# EAGLE schematic nixie_schema (EAGLE 8.2.0)

## Sheet 1 of 5: High Voltage tube driver logic
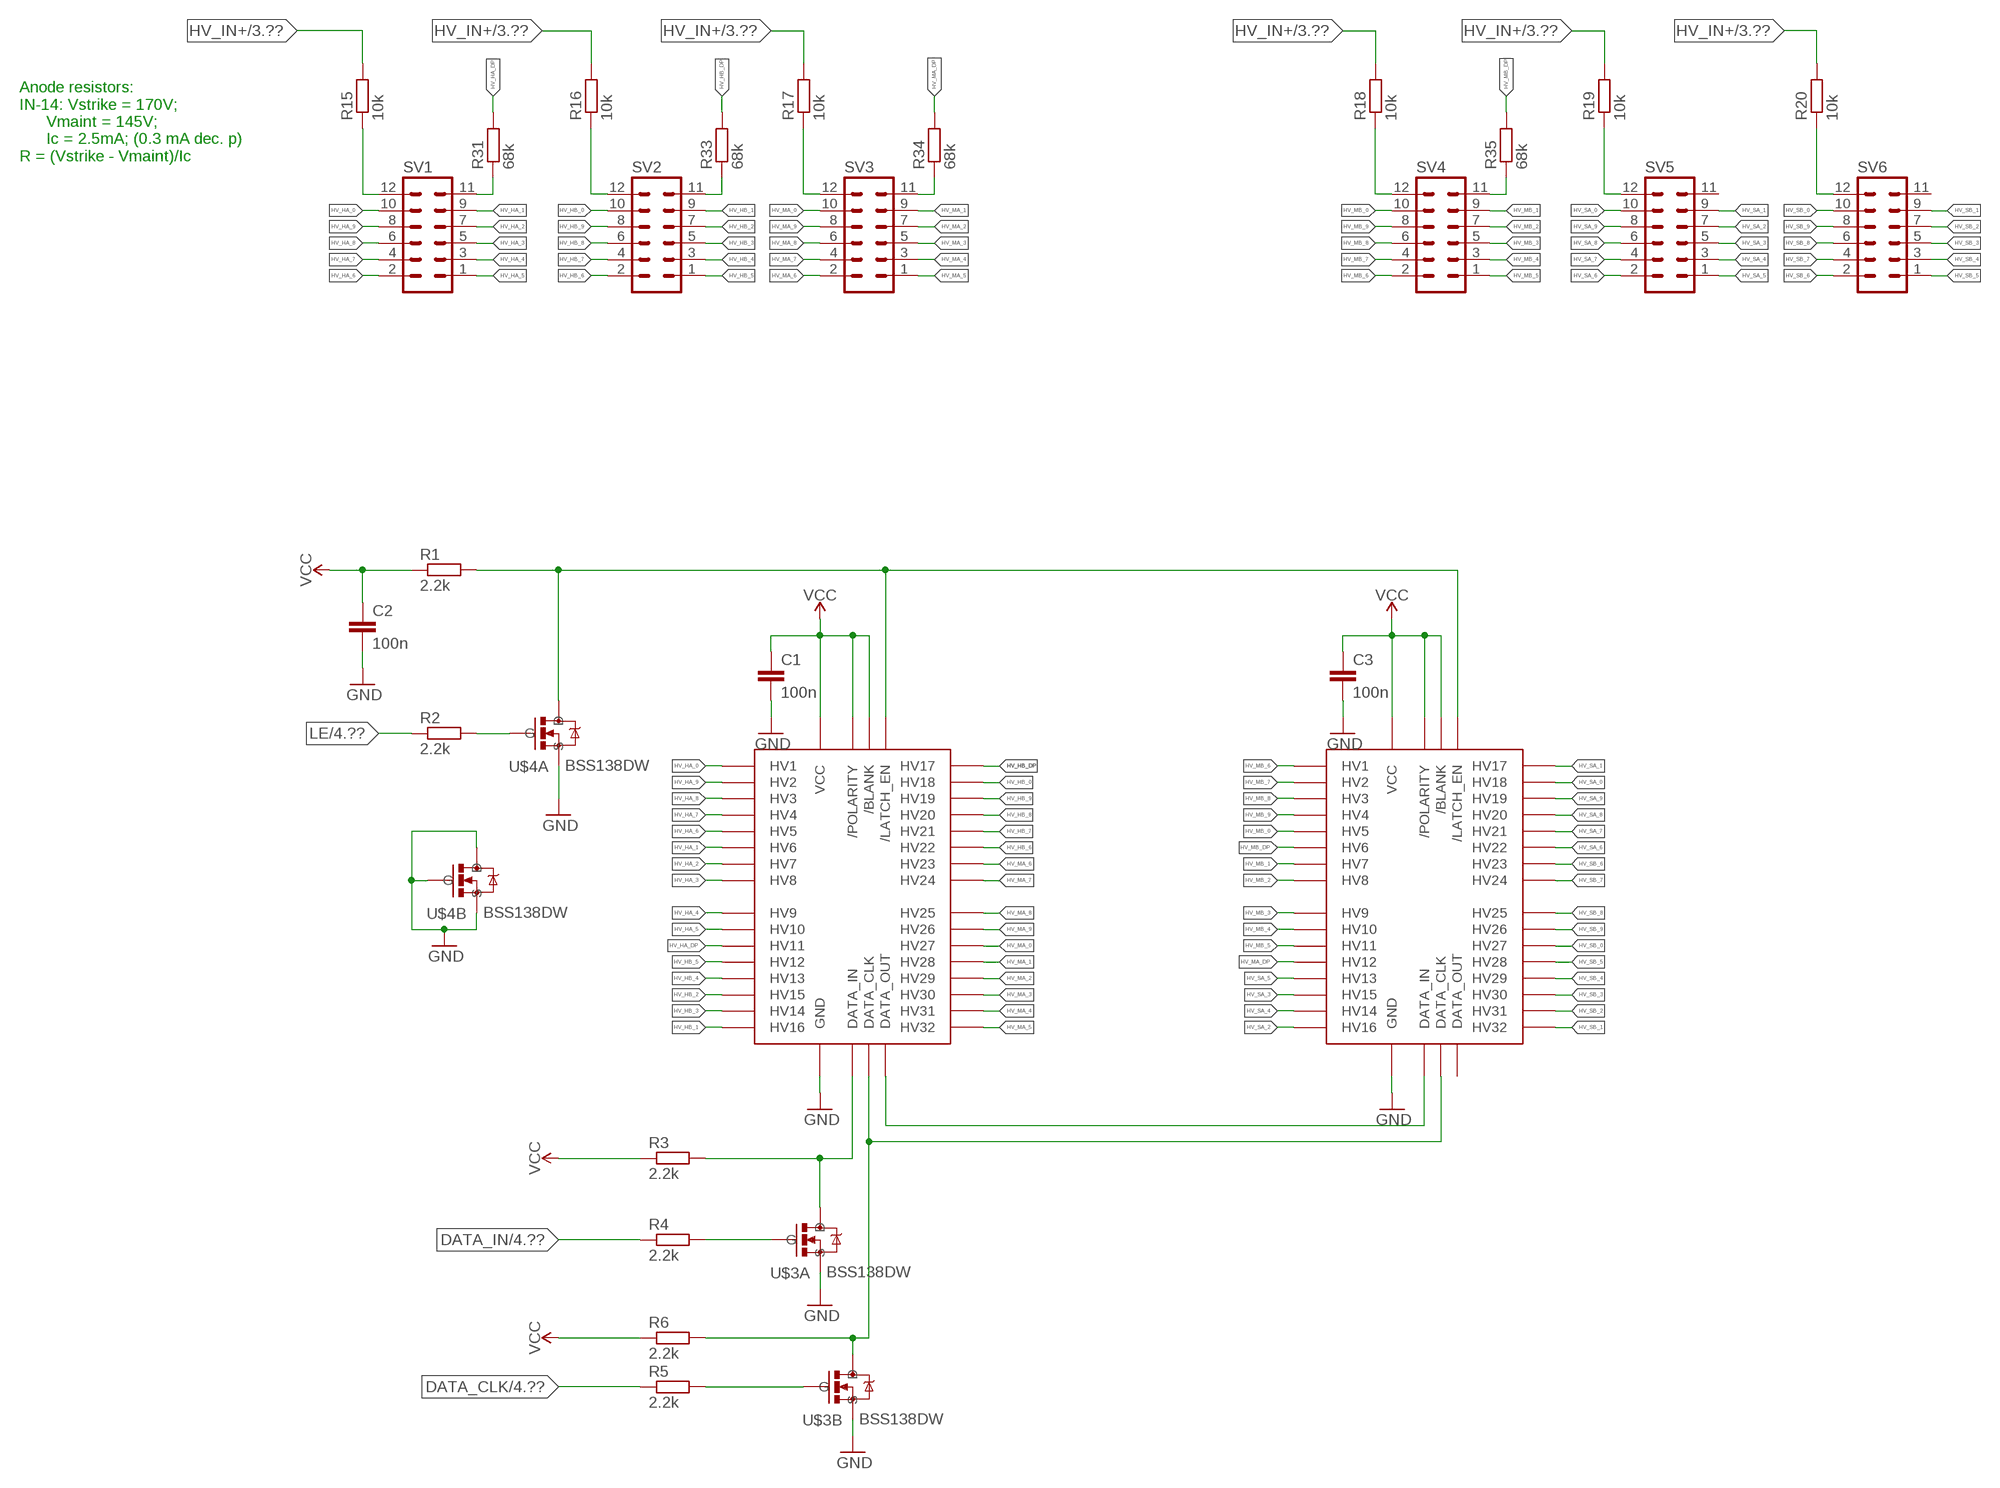
[diagram p0: schematic, sheet 1]

### Parts
C1  100n  C-EUC0805  [C0805]
C2  100n  C-EUC0805  [C0805]
C3  100n  C-EUC0805  [C0805]
R1  2.2k  R-EU_R0603  [R0603]
R2  2.2k  R-EU_R0603  [R0603]
R3  2.2k  R-EU_R0603  [R0603]
R4  2.2k  R-EU_R0603  [R0603]
R5  2.2k  R-EU_R0603  [R0603]
R6  2.2k  R-EU_R0603  [R0603]
R15  10k  R-EU_R0603  [R0603]
R16  10k  R-EU_R0603  [R0603]
R17  10k  R-EU_R0603  [R0603]
R18  10k  R-EU_R0603  [R0603]
R19  10k  R-EU_R0603  [R0603]
R20  10k  R-EU_R0603  [R0603]
R31  68k  R-EU_R0603  [R0603]
R33  68k  R-EU_R0603  [R0603]
R34  68k  R-EU_R0603  [R0603]
R35  68k  R-EU_R0603  [R0603]
SV1  MA06-2  [MA06-2]
SV2  MA06-2  [MA06-2]
SV3  MA06-2  [MA06-2]
SV4  MA06-2  [MA06-2]
SV5  MA06-2  [MA06-2]
SV6  MA06-2  [MA06-2]
U$1  HV5522  [CQFP-44]
U$2  HV5522  [CQFP-44]
U$3  BSS138DW  [SOT-363]
U$4  BSS138DW  [SOT-363]

### Nets
DATA_CLK: R5.1 ; also sheet 4
DATA_IN: R4.1 ; also sheet 4
GND: C1.2 C2.2 C3.2 U$1.24(GND) U$1.25(GND) U$1.26(GND) U$1.29(GND) U$1.34(GND) U$2.24(GND) U$2.25(GND) U$2.26(GND) U$2.29(GND) U$2.34(GND) U$3.1(A:S) U$3.4(B:S) U$4.1(A:S) U$4.3(B:D) U$4.4(B:S) U$4.5(B:G) ; also sheet 2,3,4
HV_DATA_CLK: R6.2 U$1.28(DATA_CLK) U$2.28(DATA_CLK) U$3.3(B:D)
HV_DATA_IN: R3.2 U$1.32(DATA_IN) U$3.6(A:D)
HV_DATA_OUT: U$1.23(DATA_OUT) U$2.32(DATA_IN)
HV_HA_0: SV1.10 U$1.35(HV1)
HV_HA_1: SV1.9 U$1.40(HV6)
HV_HA_2: SV1.7 U$1.41(HV7)
HV_HA_3: SV1.5 U$1.42(HV8)
HV_HA_4: SV1.3 U$1.43(HV9)
HV_HA_5: SV1.1 U$1.44(HV10)
HV_HA_6: SV1.2 U$1.39(HV5)
HV_HA_7: SV1.4 U$1.38(HV4)
HV_HA_8: SV1.6 U$1.37(HV3)
HV_HA_9: SV1.8 U$1.36(HV2)
HV_HA_DP: R31.2 U$1.1(HV11)
HV_HB_0: SV2.10 U$1.8(HV18)
HV_HB_1: SV2.9 U$1.6(HV16)
HV_HB_2: SV2.7 U$1.5(HV15)
HV_HB_3: SV2.5 U$1.4(HV14)
HV_HB_4: SV2.3 U$1.3(HV13)
HV_HB_5: SV2.1 U$1.2(HV12)
HV_HB_6: SV2.2 U$1.12(HV22)
HV_HB_7: SV2.4 U$1.11(HV21)
HV_HB_8: SV2.6 U$1.10(HV20)
HV_HB_9: SV2.8 U$1.9(HV19)
HV_HB_DP: R33.2 U$1.7(HV17)
HV_IN+ [HV]: R15.2 R16.2 R17.2 R18.2 R19.2 R20.2 ; also sheet 3
HV_LE: R1.2 U$1.31(/LATCH_EN) U$2.31(/LATCH_EN) U$4.6(A:D)
HV_MA_0: SV3.10 U$1.17(HV27)
HV_MA_1: SV3.9 U$1.18(HV28)
HV_MA_2: SV3.7 U$1.19(HV29)
HV_MA_3: SV3.5 U$1.20(HV30)
HV_MA_4: SV3.3 U$1.21(HV31)
HV_MA_5: SV3.1 U$1.22(HV32)
HV_MA_6: SV3.2 U$1.13(HV23)
HV_MA_7: SV3.4 U$1.14(HV24)
HV_MA_8: SV3.6 U$1.15(HV25)
HV_MA_9: SV3.8 U$1.16(HV26)
HV_MA_DP: R34.2 U$2.2(HV12)
HV_MB_0: SV4.10 U$2.39(HV5)
HV_MB_1: SV4.9 U$2.41(HV7)
HV_MB_2: SV4.7 U$2.42(HV8)
HV_MB_3: SV4.5 U$2.43(HV9)
HV_MB_4: SV4.3 U$2.44(HV10)
HV_MB_5: SV4.1 U$2.1(HV11)
HV_MB_6: SV4.2 U$2.35(HV1)
HV_MB_7: SV4.4 U$2.36(HV2)
HV_MB_8: SV4.6 U$2.37(HV3)
HV_MB_9: SV4.8 U$2.38(HV4)
HV_MB_DP: R35.2 U$2.40(HV6)
HV_SA_0: SV5.10 U$2.8(HV18)
HV_SA_1: SV5.9 U$2.7(HV17)
HV_SA_2: SV5.7 U$2.6(HV16)
HV_SA_3: SV5.5 U$2.5(HV15)
HV_SA_4: SV5.3 U$2.4(HV14)
HV_SA_5: SV5.1 U$2.3(HV13)
HV_SA_6: SV5.2 U$2.12(HV22)
HV_SA_7: SV5.4 U$2.11(HV21)
HV_SA_8: SV5.6 U$2.10(HV20)
HV_SA_9: SV5.8 U$2.9(HV19)
HV_SB_0: SV6.10 U$2.17(HV27)
HV_SB_1: SV6.9 U$2.22(HV32)
HV_SB_2: SV6.7 U$2.21(HV31)
HV_SB_3: SV6.5 U$2.20(HV30)
HV_SB_4: SV6.3 U$2.19(HV29)
HV_SB_5: SV6.1 U$2.18(HV28)
HV_SB_6: SV6.2 U$2.13(HV23)
HV_SB_7: SV6.4 U$2.14(HV24)
HV_SB_8: SV6.6 U$2.15(HV25)
HV_SB_9: SV6.8 U$2.16(HV26)
LE: R2.1 ; also sheet 4
N$3: R2.2 U$4.2(A:G)
N$4: R4.2 U$3.2(A:G)
N$8 [HV]: R18.1 SV4.12
N$9: R5.2 U$3.5(B:G)
N$11 [HV]: R17.1 SV3.12
N$89 [HV]: R15.1 SV1.12
N$90 [HV]: R16.1 SV2.12
N$91 [HV]: R20.1 SV6.12
N$92 [HV]: R19.1 SV5.12
N$106: R31.1 SV1.11
N$108: R33.1 SV2.11
N$110: R34.1 SV3.11
N$112: R35.1 SV4.11
VCC [Power]: C1.1 C2.1 C3.1 R1.1 R3.1 R6.1 U$1.27(/POLARITY) U$1.30(VCC) U$1.33(/BLANK) U$2.27(/POLARITY) U$2.30(VCC) U$2.33(/BLANK) ; also sheet 2,3
Unconnected: SV5.11 SV6.11 U$2.23(DATA_OUT)

### Notes on the sheet
- Anode resistors:
  IN-14: Vstrike = 170V;
        Vmaint = 145V;
        Ic = 2.5mA; (0.3 mA dec. p)
  R = (Vstrike - Vmaint)/Ic

## Sheet 2 of 5: Power Supplies Low voltage
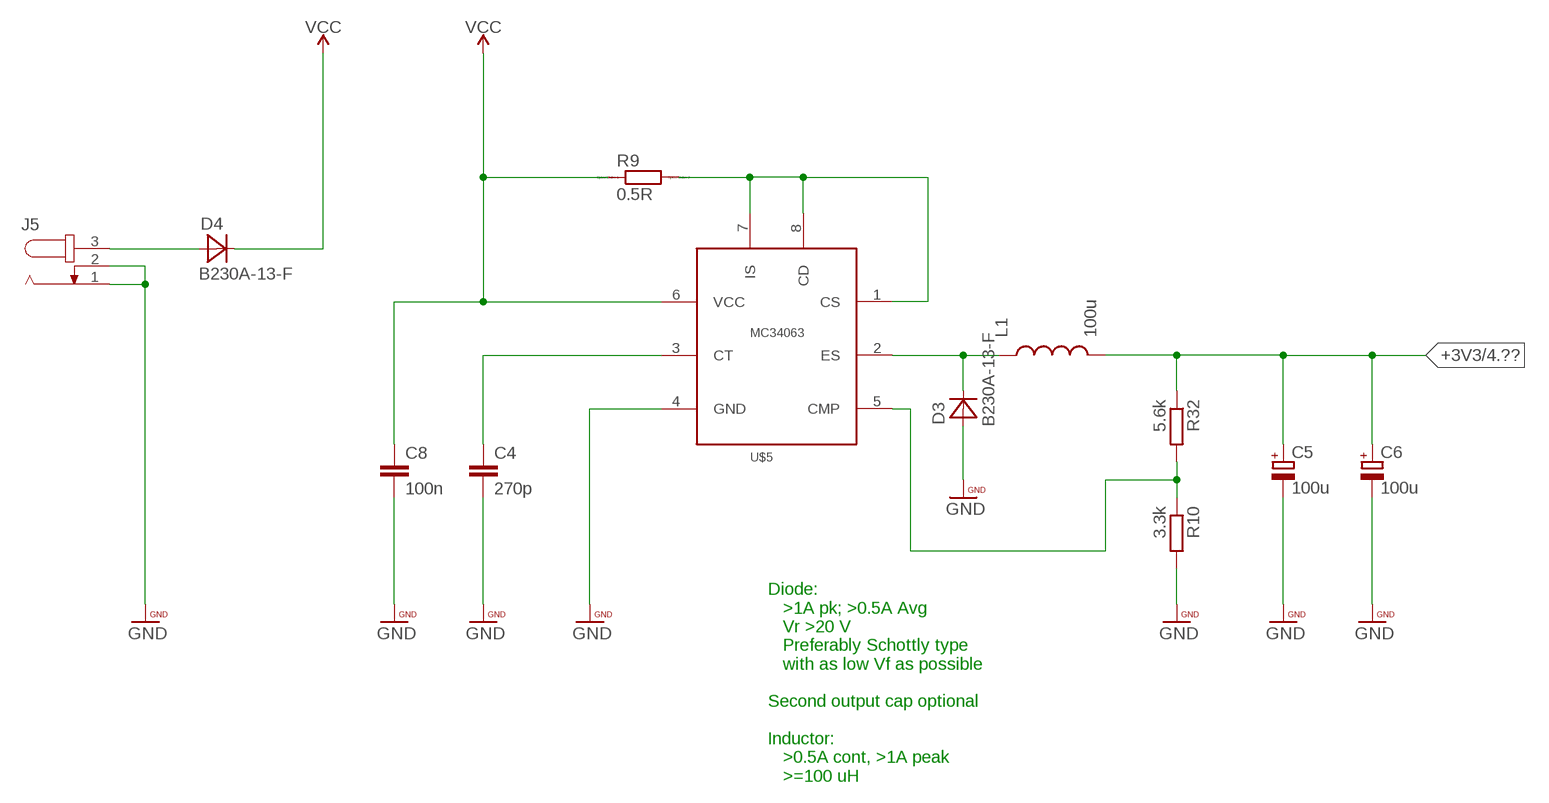
[diagram p1: schematic, sheet 2]

### Parts
C4  270p  C-EUC0805  [C0805]
C5  100u  CPOL-EU153CLV-1014  [153CLV-1014]
C6  100u  CPOL-EU153CLV-1014  [153CLV-1014]
C8  100n  C-EUC0805  [C0805]
D3  B230A-13-F  [SMA/SMB]
D4  B230A-13-F  [SMA/SMB]
J5  JACK-PLUG0  [SPC4077]
L1  100u  HM78D-128151KLFTR  [INDUCTOR_PACKAGE]
R9  0.5R  RR1210  [R1210]
R10  3.3k  R-EU_R0603  [R0603]
R32  5.6k  R-EU_R0603  [R0603]
U$5  MC34063  [SOIC08]

### Nets
+3V3 [medium power]: C5.+ C6.+ L1.P$2 R32.1 ; also sheet 4
GND: C4.2 C5.- C6.- C8.2 D3.A J5.1 J5.2 R10.2 U$5.4(GND) ; also sheet 1,3,4
N$5 [medium power]: R9.2 U$5.1(CS) U$5.7(IS) U$5.8(CD)
N$12: C4.1 U$5.3(CT)
N$13 [medium power]: D3.C L1.P$1 U$5.2(ES)
N$93 [Power]: D4.A J5.3
N$103: R10.1 R32.2 U$5.5(CMP)
VCC [Power]: C8.1 D4.C R9.1 U$5.6(VCC) ; also sheet 1,3

### Notes on the sheet
- Diode:
     >1A pk; >0.5A Avg
     Vr >20 V
     Preferably Schottly type
     with as low Vf as possible
  
  Second output cap optional
  
  Inductor:
     >0.5A cont, >1A peak
     >=100 uH

## Sheet 3 of 5: Power supply High Voltage
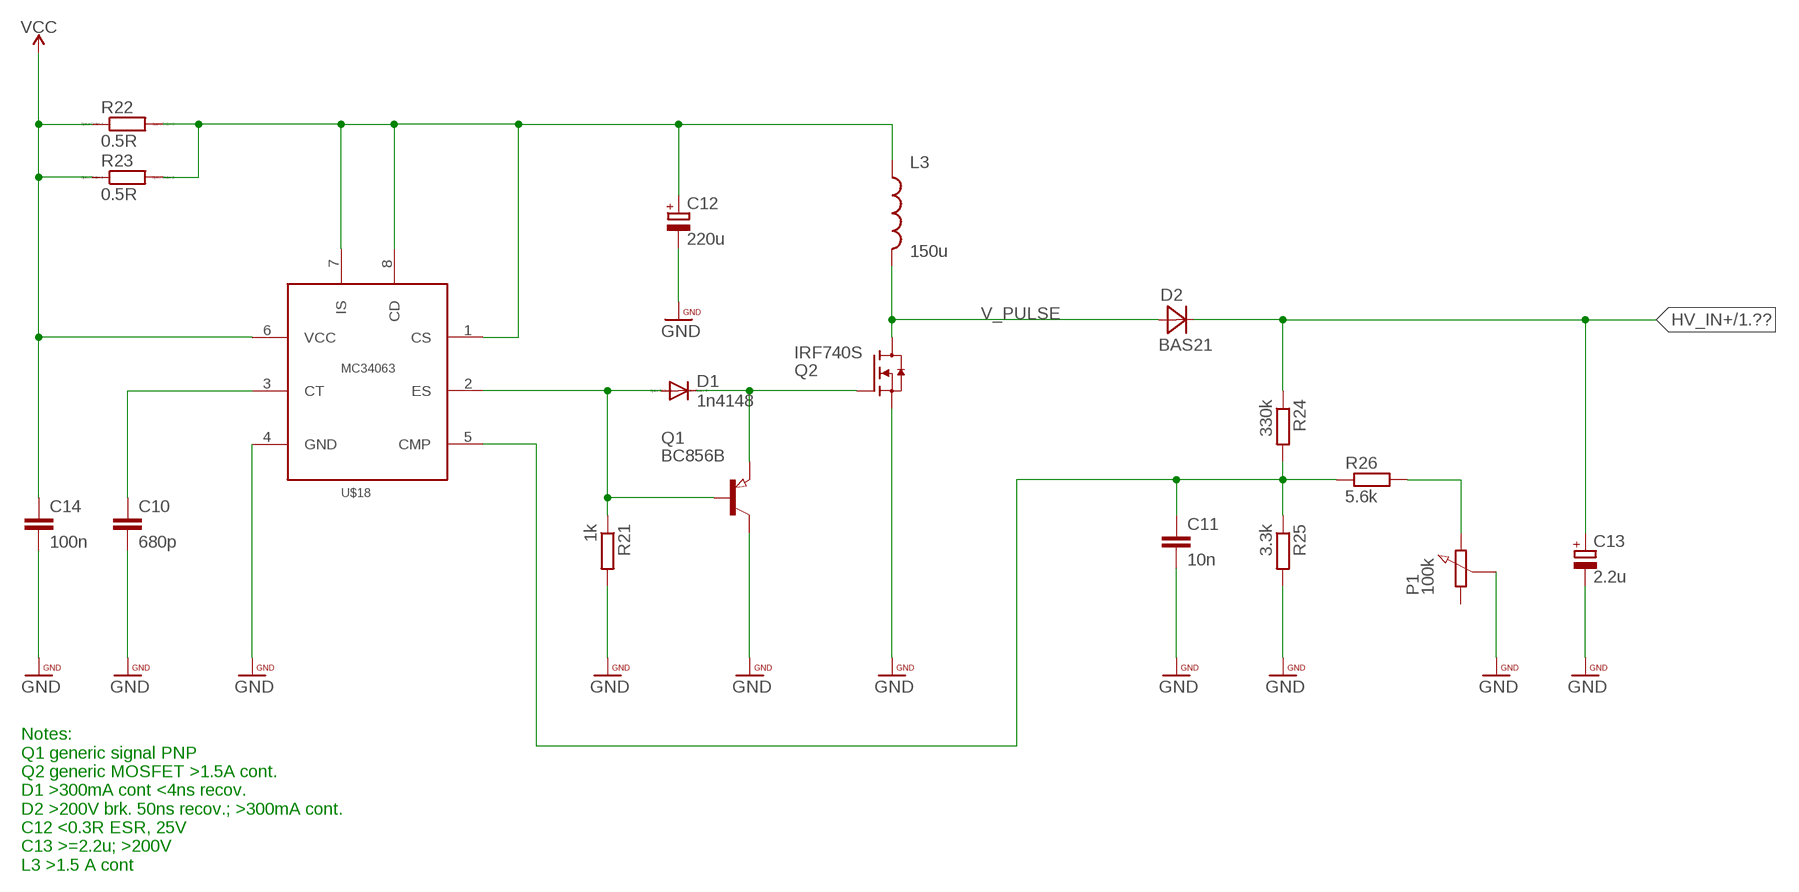
[diagram p2: schematic, sheet 3]

### Parts
C10  680p  C-EUC0805  [C0805]
C11  10n  C-EUC0805  [C0805]
C12  220u  CPOL-EU153CLV-1014  [153CLV-1014]
C13  2.2u  CPOL-EU153CLV-1014  [153CLV-1014]
C14  100n  C-EUC0805  [C0805]
D1  1n4148  DIODE-SOD123  [SOD123]
D2  BAS21  [SOT23]
L3  150u  HM78D-128151KLFTR  [INDUCTOR_PACKAGE]
P1  100k  UNIVERSAL-POTENTIOMETER_SMD  [UNI_POT_SMD]
Q1  BC856B  [SOT23]
Q2  IRF740S  [D2PACK]
R21  1k  R-EU_R0603  [R0603]
R22  0.5R  RR1210  [R1210]
R23  0.5R  RR1210  [R1210]
R24  330k  R-EU_R0603  [R0603]
R25  3.3k  R-EU_R0603  [R0603]
R26  5.6k  R-EU_R0603  [R0603]
U$18  MC34063  [SOIC08]

### Nets
GND: C10.2 C11.2 C12.- C13.- C14.2 P1.P$2(WIPER) Q1.3(C) Q2.3(S) R21.2 R25.2 U$18.4(GND) ; also sheet 1,2,4
HV_IN+ [HV]: C13.+ D2.3(C) R24.1 ; also sheet 1
N$74: C10.1 U$18.3(CT)
N$85: D1.A Q1.1(B) R21.1 U$18.2(ES)
N$87 [Power]: C12.+ L3.P$1 R22.2 R23.2 U$18.1(CS) U$18.7(IS) U$18.8(CD)
N$95: D1.C Q1.2(E) Q2.1(G)
N$96: C11.1 R24.2 R25.1 R26.1 U$18.5(CMP)
N$97: P1.P$3(E) R26.2
V_PULSE [HV]: D2.1(A) L3.P$2 Q2.2(D)
VCC [Power]: C14.1 R22.1 R23.1 U$18.6(VCC) ; also sheet 1,2
Unconnected: P1.P$1(A)

### Notes on the sheet
- Notes:
  Q1 generic signal PNP
  Q2 generic MOSFET >1.5A cont.
  D1 >300mA cont <4ns recov.
  D2 >200V brk. 50ns recov.; >300mA cont.
  C12 <0.3R ESR, 25V
  C13 >=2.2u; >200V
  L3 >1.5 A cont

## Sheet 4 of 5: ESP8266 Controller
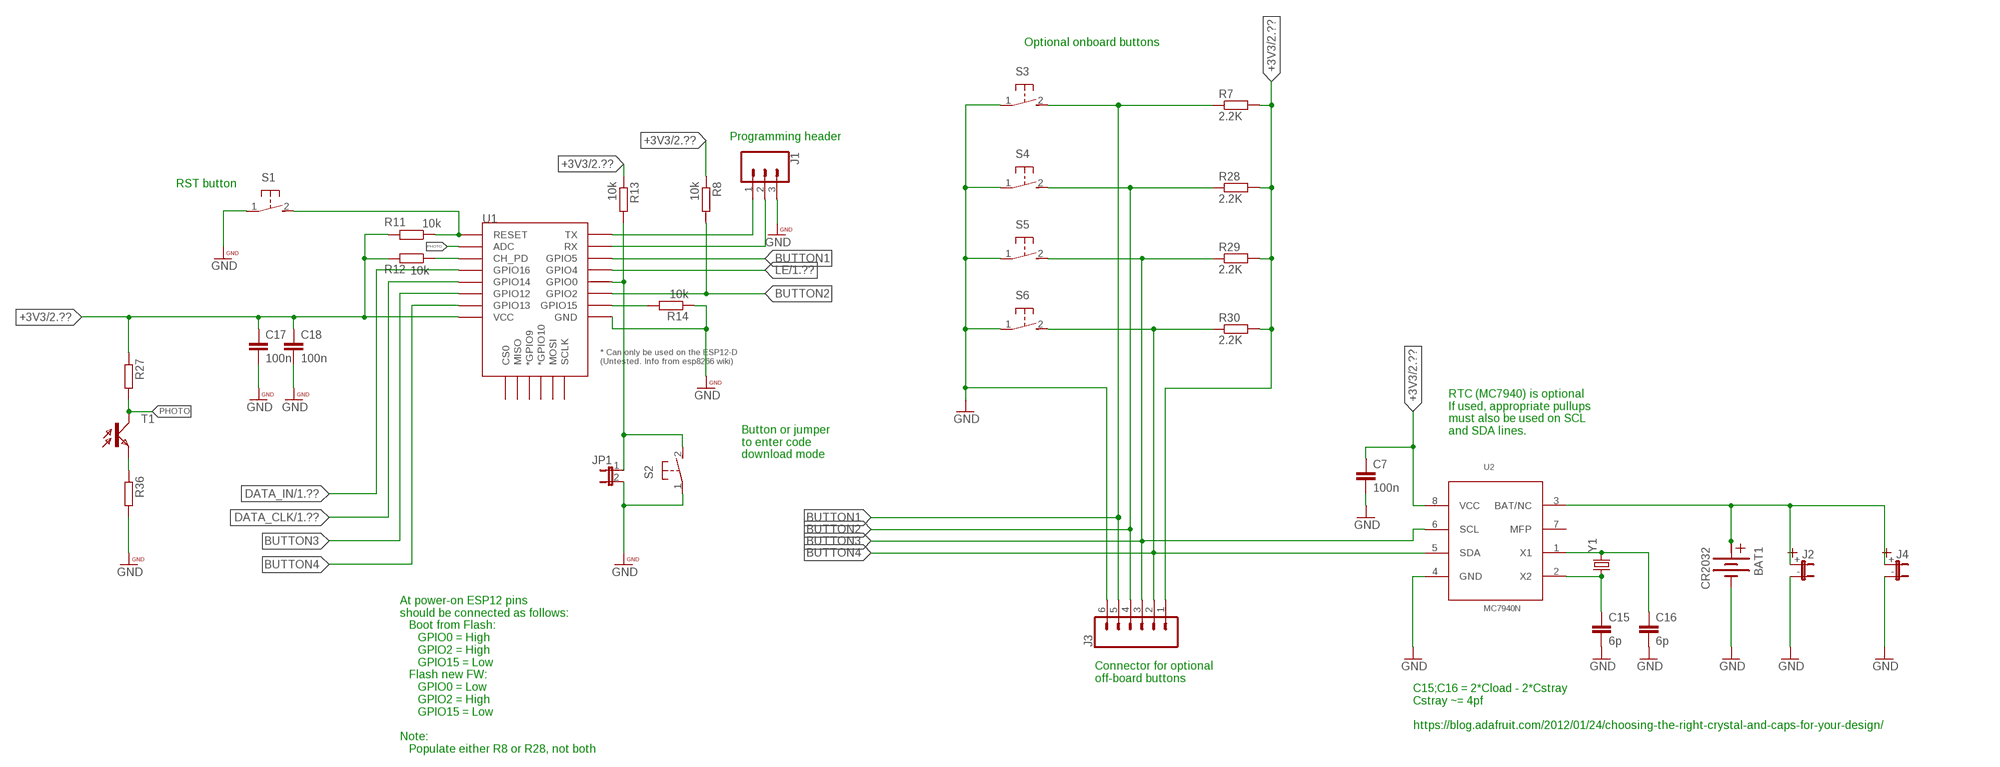
[diagram p3: schematic, sheet 4]

### Parts
BAT1  CR2032  [CR2032]
C7  100n  C-EUC0805  [C0805]
C15  6p  C-EUC0805  [C0805]
C16  6p  C-EUC0805  [C0805]
C17  100n  C-EUC0805  [C0805]
C18  100n  C-EUC0805  [C0805]
J1  CONN_03  [1X03]
J2  RTC_CONSMD  [PICOBLADE_SMD_2]
J3  CONN_06NO_SILK_FEMALE_PTH  [1X06_NO_SILK]
J4  RTC_CONTHT  [PICOBLADE_THT_2]
JP1  JUMPER2  [JUMPER2]
R7  2.2K  R-EU_R0603  [R0603]
R8  10k  R-EU_R0603  [R0603]
R11  10k  R-EU_R0603  [R0603]
R12  10k  R-EU_R0603  [R0603]
R13  10k  R-EU_R0603  [R0603]
R14  10k  R-EU_R0603  [R0603]
R27  R-EU_R0603  [R0603]
R28  2.2K  R-EU_R0603  [R0603]
R29  2.2K  R-EU_R0603  [R0603]
R30  2.2K  R-EU_R0603  [R0603]
R36  R-EU_R0603  [R0603]
S1  31-XX  [B3F-31XX]
S2  31-XX  [B3F-31XX]
S3  31-XX  [B3F-31XX]
S4  31-XX  [B3F-31XX]
S5  31-XX  [B3F-31XX]
S6  31-XX  [B3F-31XX]
T1  PHOTO_TRANS  [C0805K]
U1  ESP12ESMD  [ESP12E-SMD]
U2  MC7940N  [SOIC8-N_MC]
Y1  ECS-.327-7-34B  [CRYSTAL_PACK]

### Nets
+3V3 [medium power]: C7.1 C17.1 C18.1 J3.1 R7.2 R8.1 R11.2 R12.2 R13.1 R27.1 R28.2 R29.2 R30.2 U1.VCC U2.8(VCC) ; also sheet 2
BUTTON1: J3.5 R7.1 S3.2(S) U1.GPIO5
BUTTON2: J3.4 R8.2 R28.1 S4.2(S) U1.GPIO2
BUTTON3: J3.3 R29.1 S5.2(S) U1.GPIO12 U2.6(SCL)
BUTTON4: J3.2 R30.1 S6.2(S) U1.GPIO13 U2.5(SDA)
DATA_CLK: U1.GPIO14 ; also sheet 1
DATA_IN: U1.GPIO16 ; also sheet 1
GND: BAT1.- C7.2 C15.2 C16.2 C17.2 C18.2 J1.3 J2.- J3.6 J4.- JP1.2 R14.1 R36.2 S1.1(P) S2.1(P) S3.1(P) S4.1(P) S5.1(P) S6.1(P) U1.GND U2.4(GND) ; also sheet 1,2,3
LE: U1.GPIO4 ; also sheet 1
N$14: R11.1 S1.2(S) U1.RESET
N$15: JP1.1 R13.2 S2.2(S) U1.GPIO0
N$16: R12.1 U1.CH_PD
N$17: J1.1 U1.TXD0(TX)
N$18: J1.2 U1.RXD0(RX)
N$20: R14.2 U1.GPIO15
N$22 [medium power]: BAT1.+_1(+) J2.+ J4.+ U2.3(BAT/NC)
N$99: C16.1 U2.1(X1) Y1.P$2
N$100: C15.1 U2.2(X2) Y1.P$1
N$109: R36.1 T1.EMI(E)
PHOTO: R27.2 T1.COL(C) U1.ADC
Unconnected: U1.CS0 U1.GPIO9(*GPIO9) U1.GPIO10(*GPIO10) U1.MISO U1.MOSI U1.SCLK U2.7(MFP)

### Notes on the sheet
- Optional onboard buttons
- Programming header
- RST button
- RTC (MC7940) is optional
  If used, appropriate pullups
  must also be used on SCL
  and SDA lines.
- Button or jumper
  to enter code
  download mode
- Connector for optional
  off-board buttons
- C15;C16 = 2*Cload - 2*Cstray
  Cstray ~= 4pf
  
  https://blog.adafruit.com/2012/01/24/choosing-the-right-crystal-and-caps-for-your-design/
- At power-on ESP12 pins
  should be connected as follows:
     Boot from Flash:
        GPIO0 = High
        GPIO2 = High
        GPIO15 = Low
     Flash new FW:
        GPIO0 = Low
        GPIO2 = High
        GPIO15 = Low
  
  Note:
     Populate either R8 or R28, not both

## Sheet 5 of 5: Daugther board for Nixies
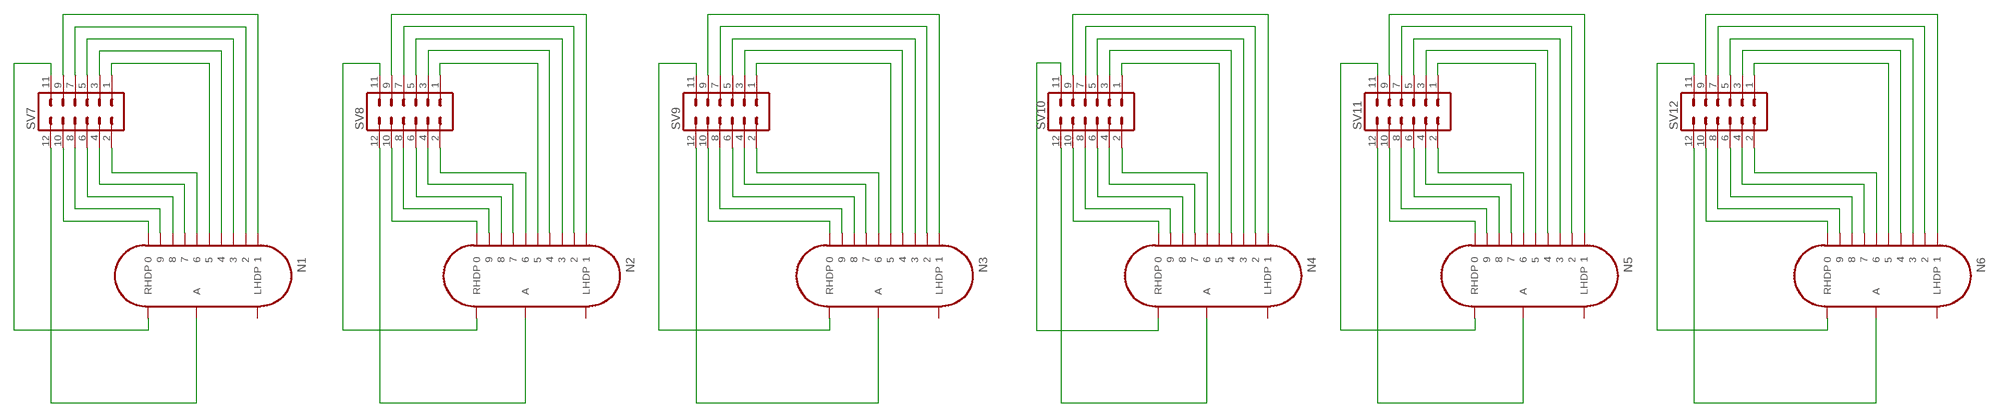
[diagram p4: schematic, sheet 5]

### Parts
N1  IN-14_FIXED  [IN-14]
N2  IN-14_FIXED  [IN-14]
N3  IN-14_FIXED  [IN-14]
N4  IN-14_FIXED  [IN-14]
N5  IN-14_FIXED  [IN-14]
N6  IN-14_FIXED  [IN-14]
SV7  MA06-2  [MA06-2]
SV8  MA06-2  [MA06-2]
SV9  MA06-2  [MA06-2]
SV10  MA06-2  [MA06-2]
SV11  MA06-2  [MA06-2]
SV12  MA06-2  [MA06-2]

### Nets
N$1: N2.RHDP SV8.11
N$2: N1.6 SV7.2
N$6: N1.7 SV7.4
N$7: N1.8 SV7.6
N$10 [HV]: N1.A SV7.12
N$19 [HV]: N2.A SV8.12
N$21 [HV]: N3.A SV9.12
N$23: N2.6 SV8.2
N$24: N1.9 SV7.8
N$25: N1.1 SV7.9
N$26: N1.2 SV7.7
N$27: N1.3 SV7.5
N$28: N1.4 SV7.3
N$29: N1.5 SV7.1
N$30: N1.RHDP SV7.11
N$31: N2.7 SV8.4
N$32: N2.8 SV8.6
N$33: N2.9 SV8.8
N$34: N2.0 SV8.10
N$35: N3.RHDP SV9.11
N$36: N3.6 SV9.2
N$37: N3.7 SV9.4
N$38: N2.5 SV8.1
N$39: N2.4 SV8.3
N$40: N2.3 SV8.5
N$41: N2.2 SV8.7
N$42: N2.1 SV8.9
N$43: N3.8 SV9.6
N$44: N3.9 SV9.8
N$45 [HV]: N6.A SV12.12
N$46: N3.0 SV9.10
N$47: N4.RHDP SV10.11
N$48: N4.6 SV10.2
N$49: N3.5 SV9.1
N$50: N3.4 SV9.3
N$51: N3.3 SV9.5
N$52: N3.2 SV9.7
N$53: N3.1 SV9.9
N$54: N4.7 SV10.4
N$55: N4.8 SV10.6
N$56: N4.9 SV10.8
N$57: N4.0 SV10.10
N$58: N5.RHDP SV11.11
N$59: N4.5 SV10.1
N$60: N4.4 SV10.3
N$61: N4.3 SV10.5
N$62: N4.2 SV10.7
N$63: N4.1 SV10.9
N$64: N5.6 SV11.2
N$65: N5.7 SV11.4
N$66: N5.8 SV11.6
N$67: N5.9 SV11.8
N$68: N5.0 SV11.10
N$69: N5.5 SV11.1
N$70: N5.4 SV11.3
N$71: N5.3 SV11.5
N$72: N5.2 SV11.7
N$73: N5.1 SV11.9
N$75: N6.RHDP SV12.11
N$76: N6.6 SV12.2
N$77: N6.7 SV12.4
N$78: N6.8 SV12.6
N$79: N6.9 SV12.8
N$80: N6.5 SV12.1
N$81: N6.4 SV12.3
N$82: N6.3 SV12.5
N$83: N6.2 SV12.7
N$84: N6.1 SV12.9
N$86: N6.0 SV12.10
N$88 [HV]: N4.A SV10.12
N$94: N1.0 SV7.10
N$98 [HV]: N5.A SV11.12
Unconnected: N1.LHDP N2.LHDP N3.LHDP N4.LHDP N5.LHDP N6.LHDP

## Power pins joined to a net without a drawn wire
+: BAT1.+_2(+)

## Library data of the parts
BAT1 = nixe_cmp:CR2032: CR2032 universal battery holder This footprint should fit many different CR2032 battery holders such as this <http://www.memoryprotectiondevices.com/datasheets/BK-912-G-TR-datasheet.pdf>, this <http://www.memoryprotectiondevices.com/datasheets/BC-2003-datasheet.pdf> or this <http://www.memoryprotectiondevices.com/datasheets/BK-913-datasheet.pdf> both SMT and THT style.
C1-C4 C7 C8 C10 C11 C14-C18 = rcl:C-EU: CAPACITOR, European symbol
C5 C6 C12 C13 = rcl:CPOL-EU: POLARIZED CAPACITOR, European symbol
D1 = diode:DIODE-: DIODE
D2 = nixe_cmp:BAS21: BAS21 200V diode General purpose 200V diode in SOT-23 package Datasheet: https://www.elfa.se/en/diode-sot-23-200-infineon-bas21/p/17030082
D3 D4 = nixe_cmp:B230A-13-F: Schottky Rectifier diode Datasheet <http://www.mouser.com/ds/2/115/ds13004-70120.pdf>; I_AVG: 2.0 A; I_FSM: 50 A; RMS_REV: 21 V; V_REV: 30 V
J1 = SparkFun-Connectors:CONN_03: Multi connection point. Often used as Generic Header-pin footprint for 0.1 inch spaced/style header connections On any of the 0.1 inch spaced packages, you can populate with these: Break Away Headers - Straight <https://www.sparkfun.com/products/116> (PRT-00116) Break Away Male Headers - Right Angle <https://www.sparkfun.com/products/553> (PRT-00553) Female Headers <https://www.sparkfun.com/products/115> (PRT-00115) Break Away Headers - Machine Pin <https://www.sparkfun.com/products/117> (PRT-00117) Break Away Female Headers - Swiss Machine Pin <https://www.sparkfun.com/products/743> (PRT-00743) Stackable Header - 3 Pin (Female, 0.1") <https://www.sparkfun.com/products/13875> (PRT-13875) For SCREWTERMINALS and SPRING TERMINALS visit here: Screw Terimnals on SparkFun.com <https://www.sparkfun.com/search/results?term=Screw+Terminals> (5mm/3.5mm/2.54mm spacing) This device is also useful as a general connection point to wire up your design to another part of your project. Our various solder wires solder well into these plated through hole pads. Hook-Up Wire - Assortment (Stranded, 22 AWG) <https://www.sparkfun.com/products/11375> (PRT-11375) Hook-Up Wire - Assortment (Solid Core, 22 AWG) <https://www.sparkfun.com/products/11367> (PRT-11367) View the entire wire category on our website here <https://www.sparkfun.com/categories/141> Special notes: Molex polarized connector foot print use with SKU : PRT-08232 with associated crimp pins and housings.
J2 J4 = nixe_cmp:RTC_CON
J3 = SparkFun-Connectors:CONN_06: Multi connection point. Often used as Generic Header-pin footprint for 0.1 inch spaced/style header connections On any of the 0.1 inch spaced packages, you can populate with these: Break Away Headers - Straight <https://www.sparkfun.com/products/116> (PRT-00116) Break Away Male Headers - Right Angle <https://www.sparkfun.com/products/553> (PRT-00553) Female Headers <https://www.sparkfun.com/products/115> (PRT-00115) Break Away Headers - Machine Pin <https://www.sparkfun.com/products/117> (PRT-00117) Break Away Female Headers - Swiss Machine Pin <https://www.sparkfun.com/products/743> (PRT-00743) Arduino Stackable Header - 6 Pin <https://www.sparkfun.com/products/9280> (PRT-09280) For SCREWTERMINALS and SPRING TERMINALS visit here: Screw Terimnals on SparkFun.com <https://www.sparkfun.com/search/results?term=Screw+Terminals> (5mm/3.5mm/2.54mm spacing) This device is also useful as a general connection point to wire up your design to another part of your project. Our various solder wires solder well into these plated through hole pads. Hook-Up Wire - Assortment (Stranded, 22 AWG) <https://www.sparkfun.com/products/11375> (PRT-11375) Hook-Up Wire - Assortment (Solid Core, 22 AWG) <https://www.sparkfun.com/products/11367> (PRT-11367) View the entire wire category on our website here <https://www.sparkfun.com/categories/141>; PROD_ID: CONN-08437
J5 = con-jack:JACK-PLUG: DC POWER JACK Power Jack, DC, Right Angle, Through Hole, Rated 5A at 16VDC, PC Terminals Distributor: Farnell (www.Farnell.de) Drawing: 84N1161.pdf / 84N1162.pdf Manufacturer: SPC Technology (www.spctechnology.com) Type: SPC4077 / SPC 4078; OC_FARNELL: unknown; OC_NEWARK: unknown
JP1 = PatternAgents-JTAG:JUMPER2: Jumper 2 Pin LBR Source: http://www.patternagents.com THIS SOFTWARE IS PROVIDED BY THE CONTRIBUTORS "AS IS" AND WITHOUT ANY EXPRESS OR IMPLIED WARRANTIES, INCLUDING, BUT NOT LIMITED TO, THE IMPLIED WARRANTIES OF MERCHANTABILITY AND FITNESS FOR A PARTICULAR PURPOSE ARE DISCLAIMED. IN NO EVENT SHALL THE COPYRIGHT OWNER OR CONTRIBUTORS BE LIABLE FOR ANY DIRECT, INDIRECT, INCIDENTAL, SPECIAL, EXEMPLARY, OR CONSEQUENTIAL DAMAGES (INCLUDING, BUT NOT LIMITED TO, PROCUREMENT OF SUBSTITUTE GOODS OR SERVICES; LOSS OF USE, DATA, OR PROFITS; OR BUSINESS INTERRUPTION) HOWEVER CAUSED AND ON ANY THEORY OF LIABILITY, WHETHER IN CONTRACT, STRICT LIABILITY, OR TORT (INCLUDING NEGLIGENCE OR OTHERWISE) ARISING IN ANY WAY OUT OF THE USE OF THIS SOFTWARE, EVEN IF ADVISED OF THE POSSIBILITY OF SUCH DAMAGE.
L1 L3 = nixe_cmp:HM78D-128151KLFTR: Inductor 150 uH 1.8A Datasheet: https://www.elfa.se/Web/Downloads/96/42/hm78_eng_tds.pdf?mime=application%2Fpdf Elfa: https://www.elfa.se/en/inductor-smd-150-uh-20-bi-technologies-hm78d-128151klftr/p/11039640?q=*&sort=Price:asc&filter_Category3=Ferrites+%2F+Inductors+%2F+Filters&filter_Category5=Inductors+%2F+Chokes%2C+SMD&filter_Category4=Inductors+%2F+Chokes&filter_Buyable=1&filter_Rated+inductance~~%C2%B5H=1000+%C2%B5H&filter_Rated+inductance~~%C2%B5H=1200+%C2%B5H&filter_Rated+inductance~~%C2%B5H=150+%C2%B5H&filter_Rated+inductance~~%C2%B5H=180+%C2%B5H&filter_Rated+inductance~~%C2%B5H=1800+%C2%B5H&filter_Rated+inductance~~%C2%B5H=2000+%C2%B5H&filter_Rated+inductance~~%C2%B5H=220+%C2%B5H&filter_Rated+inductance~~%C2%B5H=2200+%C2%B5H&filter_Rated+inductance~~%C2%B5H=248+%C2%B5H&filter_Rated+inductance~~%C2%B5H=250+%C2%B5H&filter_Rated+inductance~~%C2%B5H=256+%C2%B5H&filter_Rated+inductance~~%C2%B5H=270+%C2%B5H&filter_Rated+inductance~~%C2%B5H=2700+%C2%B5H&filter_Rated+inductance~~%C2%B5H=330+%C2%B5H&filter_Rated+inductance~~%C2%B5H=3300+%C2%B5H&filter_Rated+inductance~~%C2%B5H=377+%C2%B5H&filter_Rated+inductance~~%C2%B5H=383+%C2%B5H&filter_Rated+inductance~~%C2%B5H=390+%C2%B5H&filter_Rated+inductance~~%C2%B5H=3900+%C2%B5H&filter_Rated+inductance~~%C2%B5H=470+%C2%B5H&filter_Rated+inductance~~%C2%B5H=4700+%C2%B5H&filter_Rated+inductance~~%C2%B5H=560+%C2%B5H&filter_Rated+inductance~~%C2%B5H=6500+%C2%B5H&filter_Rated+inductance~~%C2%B5H=680+%C2%B5H&filter_Rated+inductance~~%C2%B5H=820+%C2%B5H&filter_Rated+current~~A=1.5+A&filter_Rated+current~~A=1.59+A&filter_Rated+current~~A=1.6+A&filter_Rated+current~~A=1.8+A&filter_Rated+current~~A=2.1+A&page=2&origPos=23&origPageSize=25&simi=97.1
N1-N6 = russian-nixies:IN-14_FIXED: IN-14: medium numeric frontview nixie tube
P1 = nixe_cmp:UNIVERSAL-POTENTIOMETER_SMD
Q1 = nixe_cmp:BC856B: General purpose PNP transistor Datasheet: https://www.elfa.se/Web/Downloads/7x/_e/vfBC856x-to-BC857x_e.pdf?mime=application%2Fpdf
Q2 = nixe_cmp:IRF740S: N channel MOSFET Datasheet: https://www.elfa.se/en/mosfet-400-10-125-d2pak-vishay-irf740spbf/p/17115868
R1-R7 R15-R20 R28-R31 R33-R35 = rcl:R-EU_: RESISTOR, European symbol
R8 R10-R14 R21 R24-R27 R32 R36 = resistor:R-EU_: RESISTOR, European symbol
R9 R22 R23 = eagle-ltspice:R: RESISTOR, European symbol; SPICEMODEL: NONE; SPICEPREFIX: R
S1-S6 = switch-omron:31-XX: OMRON SWITCH; MPN: B3F-3100; OC_FARNELL: 959704; OC_NEWARK: 36M3582
SV1-SV12 = con-lstb:MA06-2: PIN HEADER; OC_FARNELL: unknown; OC_NEWARK: unknown
T1 = nixe_cmp:PHOTO_TRANS: PHOTO TRANSISTOR
U1 = PatternAgents_RFmodules:ESP12E: ESP12E Module
U2 = nixe_cmp:MC7940: RTC module with optional battery backup BEWARE: M version of the part does have battery bakub, but N part DOES NOT have battery backup! Datasheet: http://ww1.microchip.com/downloads/en/DeviceDoc/20002292B.pdf; HAS_BATT: YES; VCC: 1.8-5.5V
U$1 U$2 = supertex:HV5522
U$3 U$4 = KwanSystems:BSS138DW: Transistor for bi-directional level-shifting See here <http://ics.nxp.com/support/documents/interface/pdf/an97055.pdf> for details . Two transistors in this package, can be used for two bidirectional channels.
U$5 U$18 = MC34063:MC34063
Y1 = nixe_cmp:ECS-.327-7-34B: 32 kHz Tuning fork Datasheet <http://www.ecsxtal.com/store/pdf/ecx-31b.pdf>; C_LOAD: 7 pf; ESR: 70 kOhm; FREQ: 32.768 kHz; F_TOL: +/- 20 ppm; PACKAGE: ECX-32B

## Net classes
0 default: width 0.203 mm, drill 0.5 mm, clearance 0.203 mm
1 Power: width 0.508 mm, drill 0.5 mm, clearance 0.203 mm
2 HV: width 0.254 mm, drill 0.5 mm, clearance 1 mm
3 medium power: width 0.508 mm, drill 0.5 mm, clearance 0.203 mm
4 GND pour: width 0.305 mm, drill 0.5 mm, clearance 0.305 mm